# EAGLE schematic lfo (EAGLE 6.5.0)
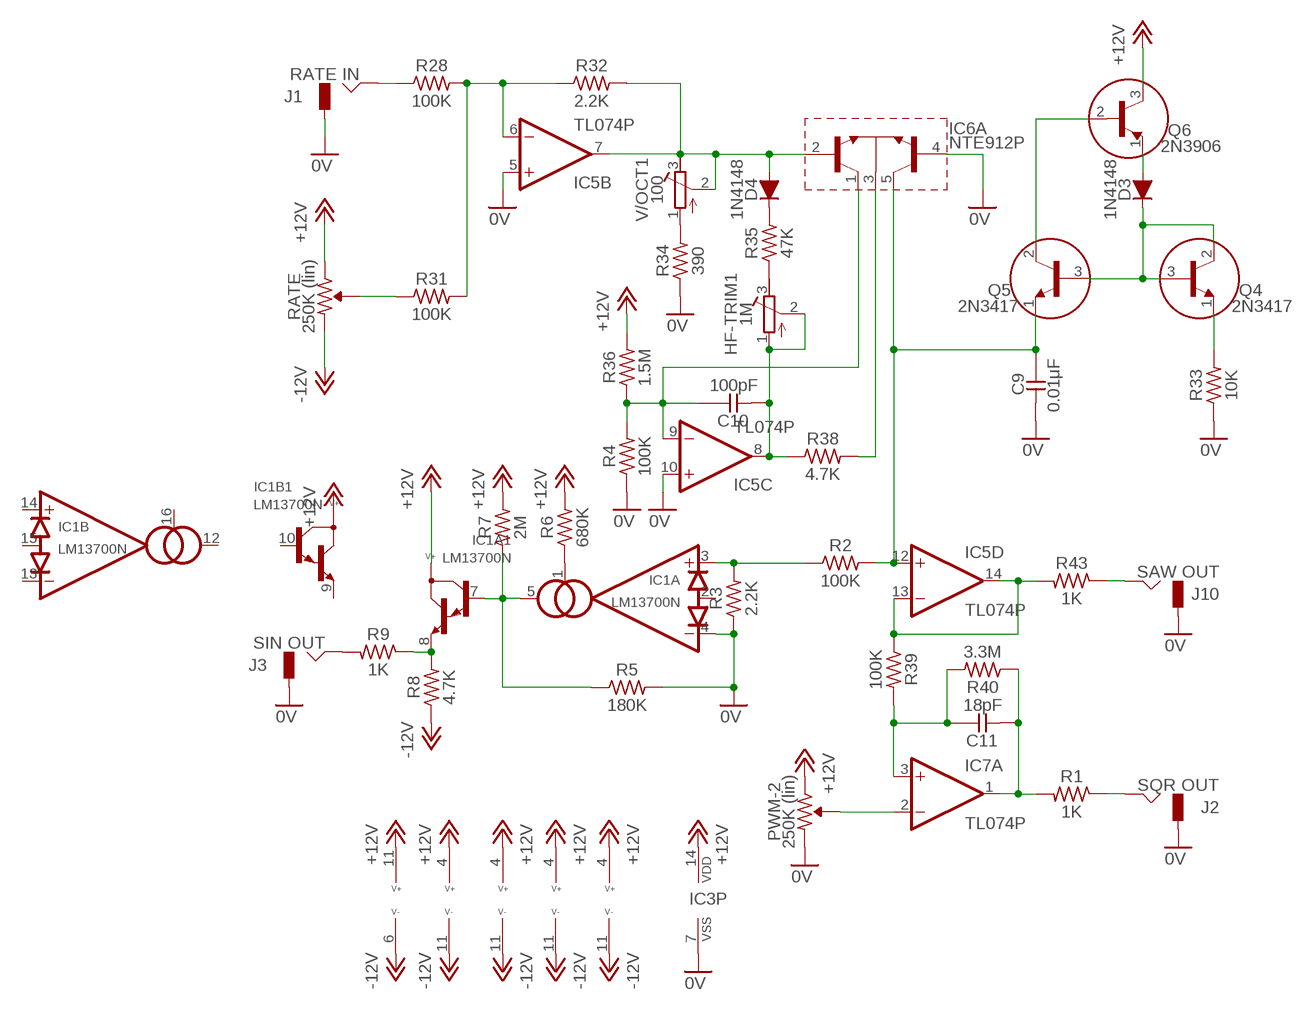
[diagram p0: schematic, sheet 1]

## Parts
C9  0.01μF  CC-US025-024X044  [C025-024X044]
C10  100pF  CC-US025-024X044  [C025-024X044]
C11  18pF  CC-US025-024X044  [C025-024X044]
D3  1N4148  [DO35-7]
D4  1N4148  [DO35-7]
HF-TRIM1  1M  R-TRIMM3304W  [RTRIM3304W]
IC1  LM13700N  [DIL-16]
IC2  TL074P  [DIL14]
IC3  4013N  [DIL14]
IC4  TL074P  [DIL14]
IC5  TL074P  [DIL14]
IC6  NTE912P  [DIL14]
IC7  TL074P  [DIL14]
J1  RATE IN  JACK-M  [JACK-M]
J2  SQR OUT  JACK-M  [JACK-M]
J3  SIN OUT  JACK-M  [JACK-M]
J10  SAW OUT  JACK-M  [JACK-M]
PWM-2  250K (lin)  R-VAR  [R-VAR]
Q4  2N3417  [TO92]
Q5  2N3417  [TO92]
Q6  2N3906  [TO92]
R1  1K  R0309/10  [0309/10]
R2  100K  R0309/10  [0309/10]
R3  2.2K  R0309/10  [0309/10]
R4  100K  R0309/10  [0309/10]
R5  180K  R0309/10  [0309/10]
R6  680K  R0309/10  [0309/10]
R7  2M  R0309/10  [0309/10]
R8  4.7K  R0309/10  [0309/10]
R9  1K  R0309/10  [0309/10]
R28  100K  R0309/10  [0309/10]
R31  100K  R0309/10  [0309/10]
R32  2.2K  R0309/10  [0309/10]
R33  10K  R0309/10  [0309/10]
R34  390  R0309/10  [0309/10]
R35  47K  R0309/10  [0309/10]
R36  1.5M  R0309/10  [0309/10]
R38  4.7K  R0309/10  [0309/10]
R39  100K  R0309/10  [0309/10]
R40  3.3M  R0309/10  [0309/10]
R43  1K  R0309/10  [0309/10]
RATE  250K (lin)  R-VAR  [R-VAR]
V/OCT1  100  R-TRIMM3304W  [RTRIM3304W]

## Nets
0V: C9.2 IC1.4(A:IN-) IC3.7(P:VSS) IC5.5(B:+IN) IC5.10(C:+IN) IC6.4(A:B3) J1.GND J2.GND J3.GND J10.GND PWM-2.R2 R3.1 R4.1 R5.2 R33.1 R34.1
+12V: IC1.11(P:V+) IC2.4(P:V+) IC3.14(P:VDD) IC4.4(P:V+) IC5.4(P:V+) IC7.4(P:V+) PWM-2.R1 Q6.3(C) R6.2 R7.2 R36.2 RATE.R1
-12V: IC1.6(P:V-) IC2.11(P:V-) IC4.11(P:V-) IC5.11(P:V-) IC7.11(P:V-) R8.1 RATE.R2
N$1: J2.HOT R1.1
N$2: IC1.3(A:IN+) R2.1 R3.2
N$4: IC1.1(A:AMP-BIAS) R6.1
N$5: IC1.5(A:OUT) IC1.7(A1:BUF-IN) R5.1
N$6: IC1.8(A1:BUF-OUT) R8.2 R9.1
N$7: J3.HOT R9.2
N$46: IC7.2(A:-IN) PWM-2.VAR
N$52: R31.1 RATE.VAR
N$54: IC5.6(B:-IN) R28.2 R31.2 R32.1
N$56: C9.1 IC5.12(D:+IN) Q5.1(E) R2.2
N$57: D3.A Q6.1(E)
N$58: Q4.1(E) R33.2
N$59: D3.C Q4.2(C) Q4.3(B) Q5.3(B)
N$60: Q5.2(C) Q6.2(B)
N$61: C10.2 HF-TRIM1.1(E) HF-TRIM1.2(S) IC5.8(C:OUT) R38.1
N$62: IC6.3(A:E) R38.2
N$63: D4.C R35.2
N$64: C10.1 IC5.9(C:-IN) R4.2 R36.1
N$65: D4.A IC5.7(B:OUT) IC6.2(A:B1) R32.2 V/OCT1.2(S) V/OCT1.3(A)
N$66: R34.2 V/OCT1.1(E)
N$67: HF-TRIM1.3(A) R35.1
N$68: IC5.13(D:-IN) IC5.14(D:OUT) R39.1 R43.2
N$69: C11.1 IC7.3(A:+IN) R39.2 R40.2
N$70: C11.2 IC7.1(A:OUT) R1.2 R40.1
N$75: J10.HOT R43.1
N$79: R28.1
Unconnected: IC1.2(A:DIODE-BIAS) IC1.9(B1:BUF-OUT) IC1.10(B1:BUF-IN) IC1.12(B:OUT) IC1.13(B:IN-) IC1.14(B:IN+) IC1.15(B:DIODE-BIAS) IC1.16(B:AMP-BIAS) IC2.1(A:OUT) IC2.2(A:-IN) IC2.3(A:+IN) IC2.5(B:+IN) IC2.6(B:-IN) IC2.7(B:OUT) IC2.8(C:OUT) IC2.9(C:-IN) IC2.10(C:+IN) IC2.12(D:+IN) IC2.13(D:-IN) IC2.14(D:OUT) IC3.1(A:Q) IC3.2(A:!Q) IC3.3(A:CLK) IC3.4(A:R) IC3.5(A:D) IC3.6(A:S) IC3.8(B:S) IC3.9(B:D) IC3.10(B:R) IC3.11(B:CLK) IC3.12(B:!Q) IC3.13(B:Q) IC4.1(A:OUT) IC4.2(A:-IN) IC4.3(A:+IN) IC4.5(B:+IN) IC4.6(B:-IN) IC4.7(B:OUT) IC4.8(C:OUT) IC4.9(C:-IN) IC4.10(C:+IN) IC4.12(D:+IN) IC4.13(D:-IN) IC4.14(D:OUT) IC5.1(A:OUT) IC5.2(A:-IN) IC5.3(A:+IN) IC6.1(A:C1) IC6.5(A:C3) IC6.6(B:B) IC6.7(B:E) IC6.8(B:C) IC6.9(C:B) IC6.10(C:E) IC6.11(C:C) IC6.12(D:B) IC6.13(D:E) IC6.14(D:C) IC7.5(B:+IN) IC7.6(B:-IN) IC7.7(B:OUT) IC7.8(C:OUT) IC7.9(C:-IN) IC7.10(C:+IN) IC7.12(D:+IN) IC7.13(D:-IN) IC7.14(D:OUT) J1.HOT R7.1

## Library data of the parts
C9-C11 = _common:CC-US: CAPACITOR, US symbol
D3 D4 = _common:1N4148: DIODE high speed (Philips)
HF-TRIM1 V/OCT1 = _common:R-TRIMM: Trimm resistor
IC1 = _common:LM13700: Dual Operational Transconductance Amplifier with Linearizing Diodes and Buffers
IC2 IC4 IC5 IC7 = _common:TL074: OP AMP
IC3 = 40xx:4013: Dual D FLIP FLOP, set/reset
IC6 = _common:NTE912: NPN TRANSISTOR ARRAY
J1-J3 J10 = _common:JACK-M
PWM-2 RATE = _common:R-VAR
Q4 Q5 = _common:2N3417: NPN Transistor
Q6 = _common:2N3906: PNP Transistor
R1-R9 R28 R31-R36 R38-R40 R43 = _common:R: RESISTOR, US symbol